# Altium project apt_battery_cell.PrjPCB
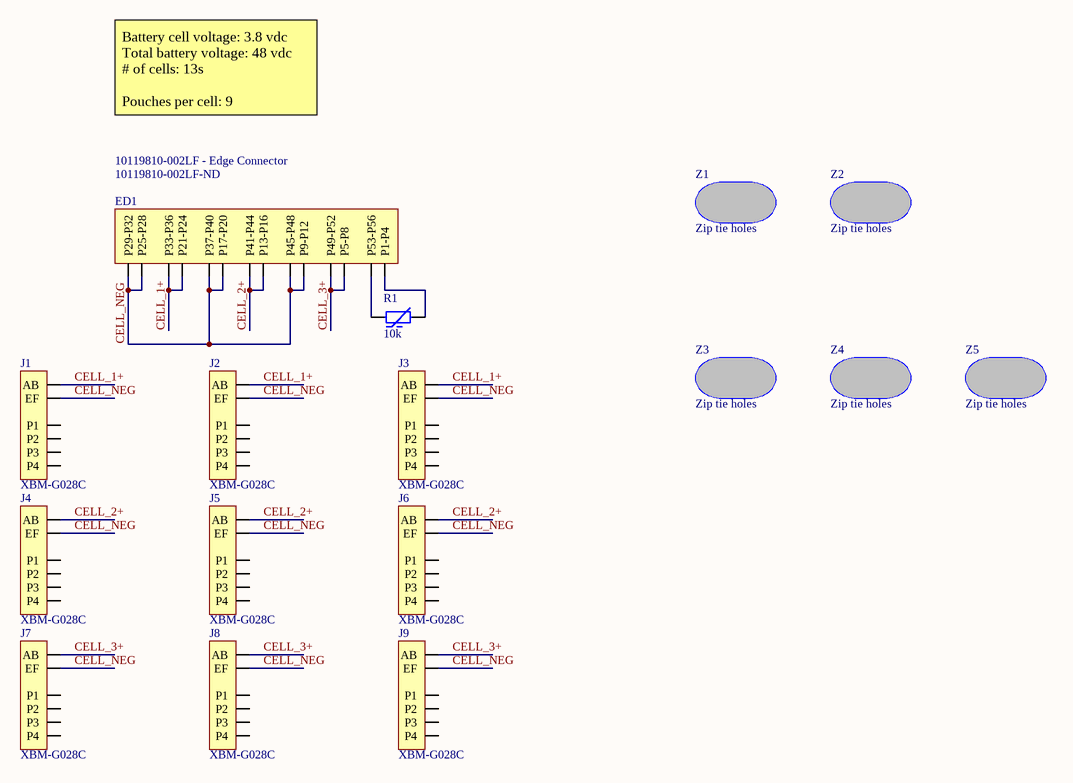
[diagram p0: battery_cell.SchDoc]
1 sheet, 16 parts. Net scope: global (net labels, ports and power ports of the same name join across sheets).
Board file: apt_battery_cell.PcbDoc

## Sheet battery_cell.SchDoc
size Tabloid

### Parts
ED1  10119810-002LF - Edge Connector  Supplier Part Number 1: 10119810-002LF-ND  [10119810-002LF - Edge Connector]
J1  XBM-G028C  [XBM-G028A]
J2  XBM-G028C  [XBM-G028A]
J3  XBM-G028C  [XBM-G028A]
J4  XBM-G028C  [XBM-G028A]
J5  XBM-G028C  [XBM-G028A]
J6  XBM-G028C  [XBM-G028A]
J7  XBM-G028C  [XBM-G028A]
J8  XBM-G028C  [XBM-G028A]
J9  XBM-G028C  [XBM-G028A]
R1  10k  [NTC 0603_1608]
Z1  Zip tie holes  [ZIP_TIE_HOLE]
Z2  Zip tie holes  [ZIP_TIE_HOLE]
Z3  Zip tie holes  [ZIP_TIE_HOLE]
Z4  Zip tie holes  [ZIP_TIE_HOLE]
Z5  Zip tie holes  [ZIP_TIE_HOLE]

### Nets
CELL_1+: ED1.P21-P24 ED1.P33-P36 J1.AB J2.AB J3.AB
CELL_2+: ED1.P13-P16 ED1.P41-P44 J4.AB J5.AB J6.AB
CELL_3+: ED1.P5-P8 ED1.P49-P52 J7.AB J8.AB J9.AB
CELL_NEG: ED1.P9-P12 ED1.P17-P20 ED1.P25-P28 ED1.P29-P32 ED1.P37-P40 ED1.P45-P48 J1.EF J2.EF J3.EF J4.EF J5.EF J6.EF J7.EF J8.EF J9.EF
NetED1_P1-P4: ED1.P1-P4 R1.2
NetED1_P53-P56: ED1.P53-P56 R1.1

Not connected (* = marked no-connect by the designer): J1 P1 P2 P3 P4; J2 P1 P2 P3 P4; J3 P1 P2 P3 P4; J4 P1 P2 P3 P4; J5 P1 P2 P3 P4; J6 P1 P2 P3 P4; J7 P1 P2 P3 P4; J8 P1 P2 P3 P4; J9 P1 P2 P3 P4

### Notes on the sheet
- Battery cell voltage: 3.8 vdc
  Total battery voltage: 48 vdc
  # of cells: 13s
  Pouches per cell: 9

### Library data of the parts
J1-J9 = XBM-G028C: 28 pos power connector  (0.8X1.6mm pitch)-with post; Manufacturer: Neoconix; Manufacturer Part Number: XBM-G028C
R1 = NTCS0603E3103FMT: THERMISTOR NTC 10KOHM 3610K 0603; Manufacturer: Vishay BC Components; B Value Tolerance: ±1%; Power - Max: 125mW; Part Number: NTCS0603E3103FMT; B25/85: 3610K; ComponentLink1Description: Datasheet; ComponentLink1URL: http://www.vishay.com/docs/29056/ntcs0603e3t.pdf; ComponentLink2Description: DigiKey Link; ComponentLink2URL: http://digikey.com/product-detail/en/vishay-bc-components/NTCS0603E3103FMT/BC2472CT-ND/2230853; Device Package: 0603 (1608 Metric); LastUpdated: 9/2/2020 1:22:38 AM; Lifecycle Status: Active; Minimum Order: 1; Mounting Type: Surface Mount; Operating Temperature: -40°C ~ 150°C; Package / Case: 0603 (1608 Metric); Packaging: TapeAndReel; PartId: 450; Part Status: Active; Price: 0.38; Resistance in Ohms @ 25°C: 10k; Resistance Tolerance: ±1%; Series: Automotive, AEC-Q200; Supplier 1: DigiKey; Supplier Part Number 1: BC2472CT-ND; Value: 10k
Z1-Z5 = ZIP_TIE_HOLE
ED1 = 10119810-002LF - Edge Connector: Supplier 1: Digi-Key; System: Connector